# Altium schematic sheet Precharge.SchDoc
size A3
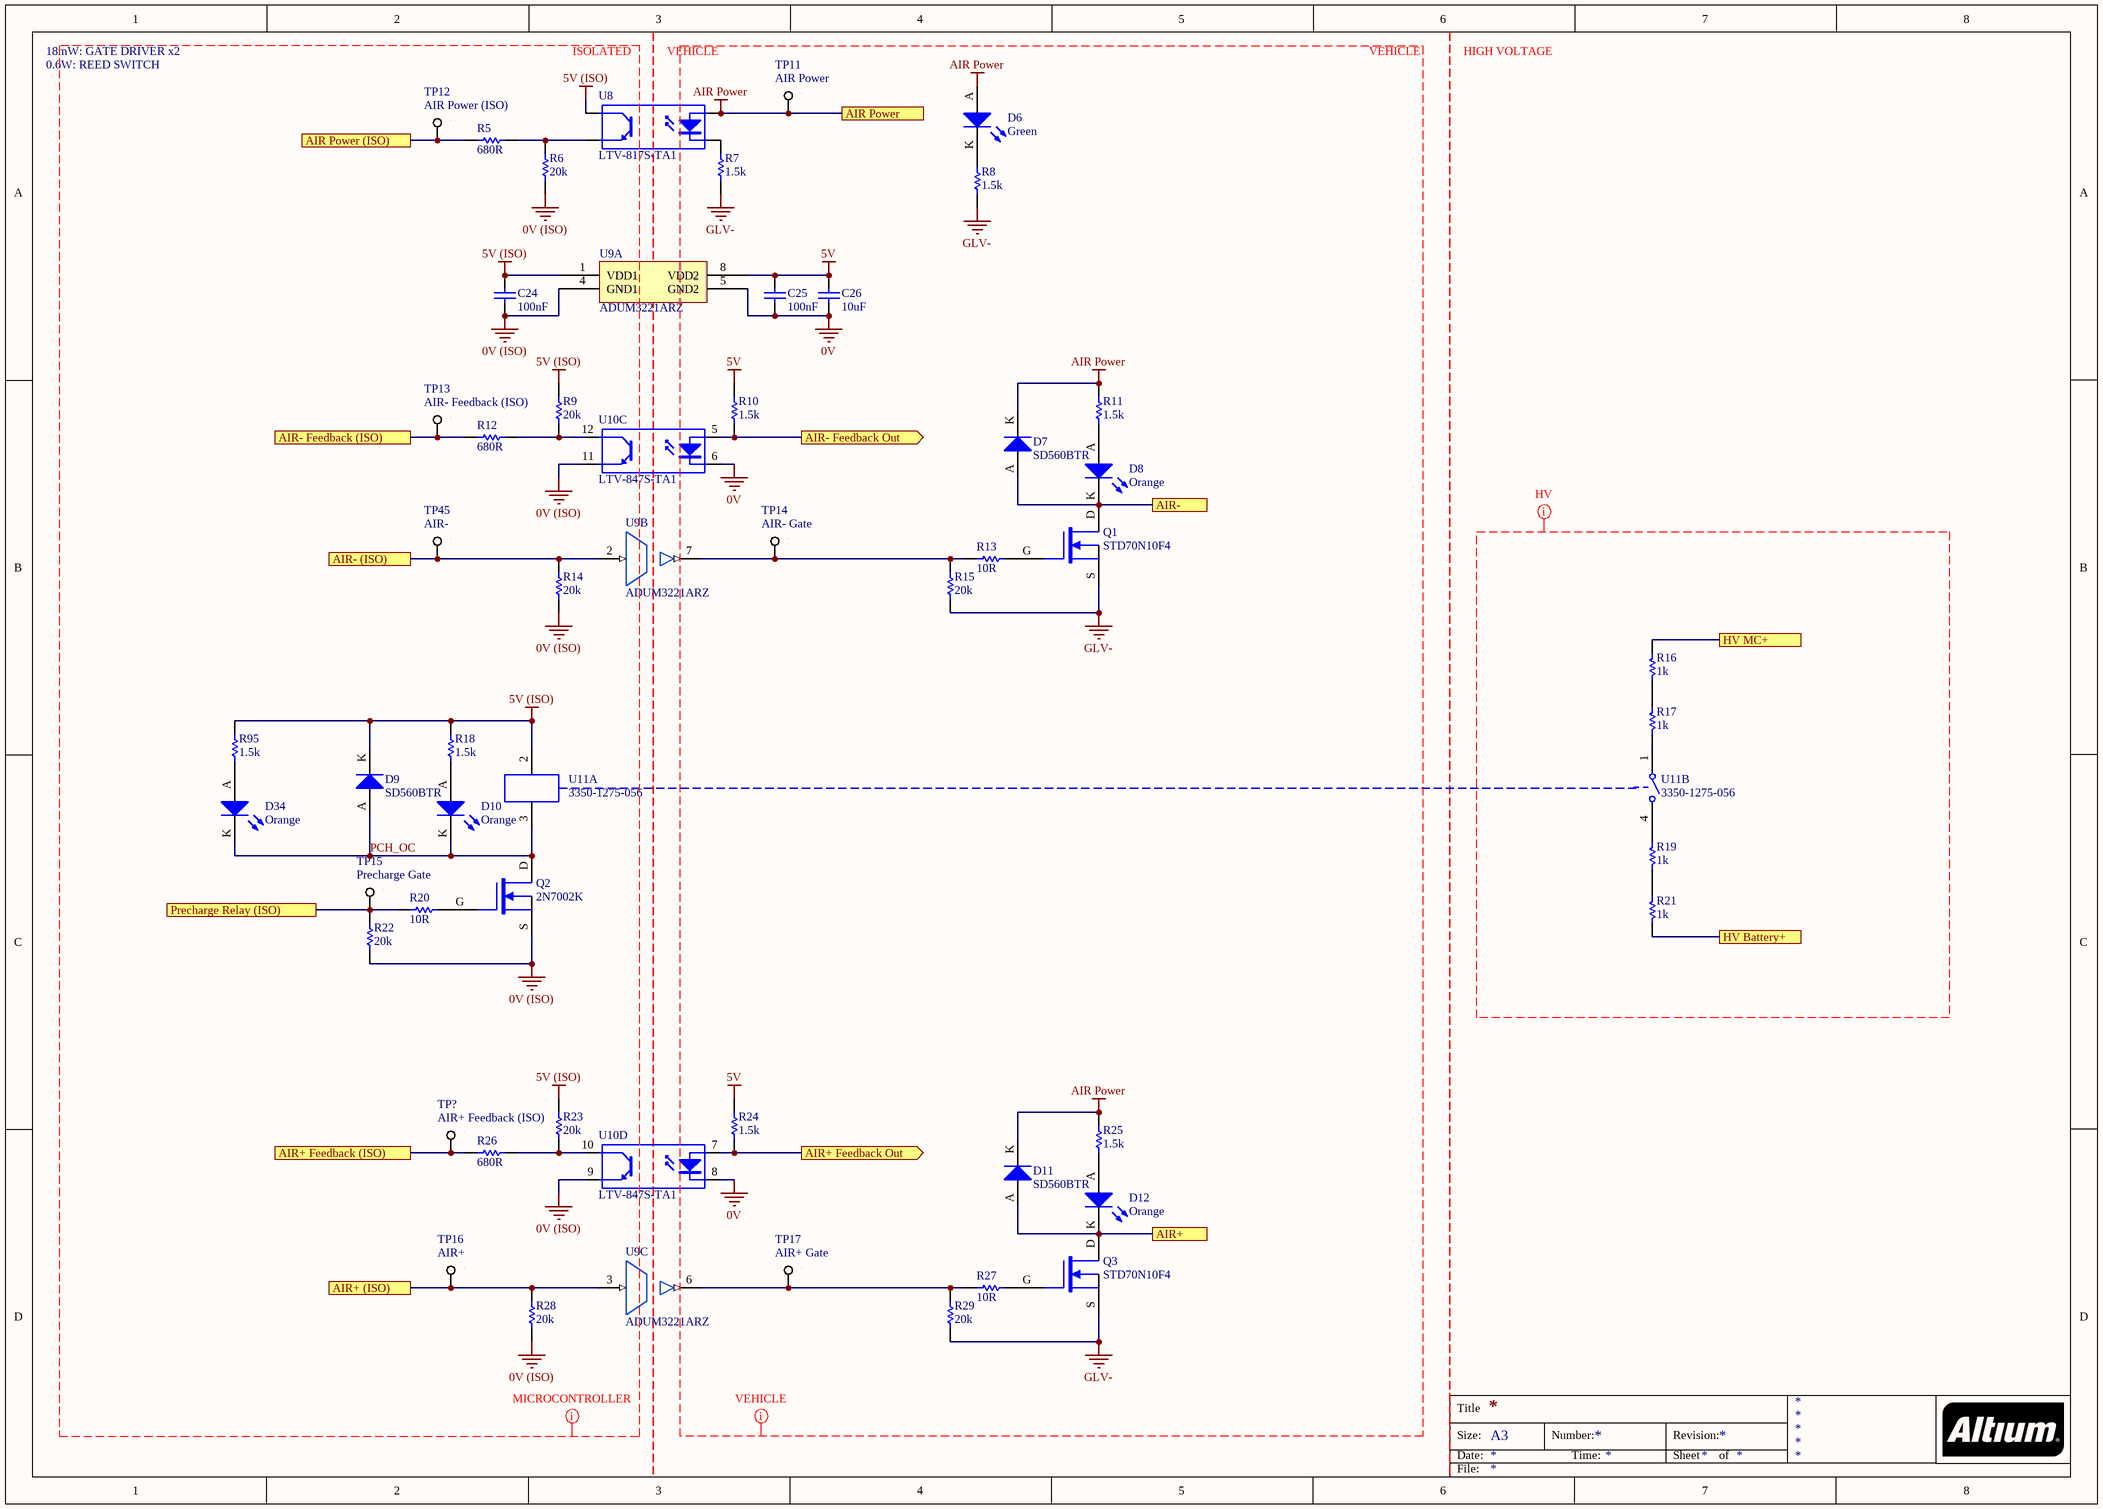
[diagram p0: Precharge.SchDoc]

## Parts
C24  100nF  [0805]
C25  100nF  [0805]
C26  10uF  [0805]
D6  Green  [0805 LED]
D7  SD560BTR  [SMB Diode]
D8  Orange  [0805 LED]
D9  SD560BTR  [SMB Diode]
D10  Orange  [0805 LED]
D11  SD560BTR  [SMB Diode]
D12  Orange  [0805 LED]
D34  Orange  [0805 LED]
Q1  STD70N10F4  [STM TO-252 MOSFET]
Q2  2N7002K  [ON SOT-23 MOSFET]
Q3  STD70N10F4  [STM TO-252 MOSFET]
R5  680R  [0805]
R6  20k  [0805]
R7  1.5k  [0805]
R8  1.5k  [0805]
R9  20k  [0805]
R10  1.5k  [0805]
R11  1.5k  [0805]
R12  680R  [0805]
R13  10R  [0805]
R14  20k  [0805]
R15  20k  [0805]
R16  1k  [B TO-263]
R17  1k  [B TO-263]
R18  1.5k  [0805]
R19  1k  [B TO-263]
R20  10R  [0805]
R21  1k  [B TO-263]
R22  20k  [0805]
R23  20k  [0805]
R24  1.5k  [0805]
R25  1.5k  [0805]
R26  680R  [0805]
R27  10R  [0805]
R28  20k  [0805]
R29  20k  [0805]
R95  1.5k  [0805]
TP11  AIR Power  [SMD Test Point 1mm]
TP12  AIR Power (ISO)  [SMD Test Point 1mm]
TP13  AIR- Feedback (ISO)  [SMD Test Point 1mm]
TP14  AIR- Gate  [SMD Test Point 1mm]
TP15  Precharge Gate  [SMD Test Point 1mm]
TP16  AIR+  [SMD Test Point 1mm]
TP17  AIR+ Gate  [SMD Test Point 1mm]
TP45  AIR-  [SMD Test Point 1mm]
TP?  AIR+ Feedback (ISO)  [SMD Test Point 1mm]
U8  LTV-817S-TA1  [ON 4-SMD]
U9  ADUM3221ARZ  [AD 8-SOIC]  (parts A,B,C of 3)
U10  LTV-847S-TA1  [ON 16-SMD]  (parts C,D of 4)
U11  3350-1275-056  [CI SPST]  (parts A,B of 2)

## Ports
AIR Power, AIR Power (ISO), AIR+, AIR+ (ISO), AIR+ Feedback (ISO), AIR+ Feedback Out (out), AIR-, AIR- (ISO), AIR- Feedback (ISO), AIR- Feedback Out (out), HV Battery+, HV MC+, Precharge Relay (ISO)

## Nets
0V: C25.1 C26.1 U9.5(GND2) U10.6(K) U10.8(K)
0V (ISO): C24.1 Q2.S R6.1 R14.1 R22.1 R28.1 U9.4(GND1) U10.9(E) U10.11(E)
5V: C25.2 C26.2 R10.2 R24.2 U9.8(VDD2)
5V (ISO): C24.2 D9.K R9.2 R18.2 R23.2 R95.2 U8.4(C) U9.1(VDD1) U11.2
AIR Power: D6.A D7.K D11.K R11.2 R25.2 TP11.1 U8.1(A) ; port AIR Power
GLV-: Q1.S Q3.S R7.2 R8.2 R15.1 R29.1
AIR Power (ISO): R5.1 TP12.1 ; port AIR Power (ISO)
AIR+: D11.A D12.K Q3.D ; port AIR+
AIR+ (ISO): R28.2 TP16.1 U9.3(VIA) ; port AIR+ (ISO)
AIR+ Feedback (ISO): R26.1 TP?.1 ; port AIR+ Feedback (ISO)
AIR+ Feedback Out: R24.1 U10.7(A) ; port AIR+ Feedback Out
AIR-: D7.A D8.K Q1.D ; port AIR-
AIR- (ISO): R14.2 TP45.1 U9.2(VIA) ; port AIR- (ISO)
AIR- Feedback (ISO): R12.1 TP13.1 ; port AIR- Feedback (ISO)
AIR- Feedback Out: R10.1 U10.5(A) ; port AIR- Feedback Out
HV Battery+: R21.1 ; port HV Battery+
HV MC+: R16.2 ; port HV MC+
PCH_OC: D9.A D10.K D34.K Q2.D U11.3
Precharge Relay (ISO): R20.1 R22.2 TP15.1 ; port Precharge Relay (ISO)
NetD6_K: D6.K R8.1
NetD8_A: D8.A R11.1
NetD10_A: D10.A R18.1
NetD12_A: D12.A R25.1
NetD34_A: D34.A R95.1
NetQ1_G: Q1.G R13.2
NetQ2_G: Q2.G R20.2
NetQ3_G: Q3.G R27.2
NetR5_2: R5.2 R6.2 U8.3(E)
NetR7_1: R7.1 U8.2(K)
NetR9_1: R9.1 R12.2 U10.12(C)
NetR13_1: R13.1 R15.2 TP14.1 U9.7(VOA)
NetR16_1: R16.1 R17.2
NetR17_1: R17.1 U11.1
NetR19_1: R19.1 R21.2
NetR19_2: R19.2 U11.4
NetR23_1: R23.1 R26.2 U10.10(C)
NetR27_1: R27.1 R29.2 TP17.1 U9.6(VOA)

## Layout directives
net class HV: (no net found under the mark)
net class VEHICLE: 0V, 5V, AIR Power, GLV-
net class MICROCONTROLLER: 0V (ISO), 5V (ISO), PCH_OC

## Notes on the sheet
- 18mW: GATE DRIVER x2
- 0.6W: REED SWITCH
- ISOLATED
- VEHICLE
- HIGH VOLTAGE
- Title
- Size:
- Date:
- A3
- Number:
- Time:
- Revision:
- Sheet
- of
- File:

## Library data of the parts
C24 C25 = GCM21BR71H104KA37L: Manufacturer: muRata; Tolerance: ±10%; Material: X7R; Rated Voltage: 50V; Part Number: GCM21BR71H104KA37L; Value: 100nF; Digikey Part Number: 490-6064-1-ND
C26 = GRM21BR6YA106KE43L: Manufacturer: muRata; Tolerance: 10%; Material: X5R; Rated Voltage: 50V; Part Number: GRM21BR6YA106KE43L; Value: 10uF; Digikey Part Number: 490-10514-6-ND
D6 = SML-210FTT86: Green LED Indication - Discrete 1.75V 0805 (2012 Metric); Manufacturer: ROHM Semiconductor; Part Number: SML-210FTT86; Colour: Green; Digikey Part Number: 511-1285-1-ND; Digikey Link: https://www.digikey.com/product-detail/en/rohm-semiconductor/SML-210FTT86/511-1285-1-ND/637098
D7 D9 D11 = SD560BTR: 1.2V_F 600V 5A SMB; Manufacturer: SMC Diode Solutions; Part Number: SD560BTR; Digikey Part Number: 1655-1530-2-ND; Digikey Link: https://www.digikey.com/product-detail/en/smc-diode-solutions/SD560BTR/1655-1530-2-ND/6022620
D8 D10 D12 D34 = SML-211DTT86: Orange LED Indication - Discrete 1.75V 0805 (2012 Metric); Manufacturer: ROHM Semiconductor; Part Number: SML-211DTT86; Colour: Orange; Digikey Part Number: 511-1291-1-ND; Digikey Link: https://www.digikey.com/product-detail/en/rohm-semiconductor/SML-211DTT86/511-1291-1-ND/637104
Q1 Q3 = STD70N10F4: N-Channel 100V 60A (Tc) 125W (Tc) Surface Mount DPAK; Manufacturer: STMicroelectronics; Published: 24-Mar-1999; LatestRevisionDate: 29-May-2009; LatestRevisionNote: IPC-7351 Footprint Added.; PackageVersion: Sep-2000; PackageReference: SOT-343; Publisher: Altium Limited; PackageDescription: 4-Pin SOT-343 Package 1.3 mm Pitch, 2.1 mm Lead Span; Part Number: STD70N10F4; Digikey Part Number: 497-8806-2-ND; Digikey Link: https://www.digikey.com/product-detail/en/stmicroelectronics/STD70N10F4/497-8806-2-ND/2035599
Q2 = 2N7002K: 60V 380mA, NFET MOSTFET (Small Signal); Manufacturer: ON Semiconductor; Published: 24-Mar-1999; LatestRevisionDate: 29-May-2009; LatestRevisionNote: IPC-7351 Footprint Added.; PackageVersion: Sep-2000; PackageReference: SOT-343; Publisher: Altium Limited; PackageDescription: 4-Pin SOT-343 Package 1.3 mm Pitch, 2.1 mm Lead Span; Part Number: 2N7002K; Digikey Part Number: 2N7002KCT-ND; Digikey Link: https://www.digikey.com/product-detail/en/on-semiconductor/2N7002K/2N7002KCT-ND/2060375; Qty: 30
R5 R12 R26 = RC0805FR07680RL: Manufacturer: YAGEO; Tolerance: 0.01; Rated Voltage: 0.125W; Part Number: RC0805FR07680RL; Value: 680R; Material: FR-07; Digikey Part Number: 311-680CRCT-ND
R6 R9 R14 R15 R22 R23 R28 R29 = RC0805FR0720KL: Manufacturer: YAGEO; Tolerance: 0.01; Rated Voltage: 0.125W; Part Number: RC0805FR0720KL; Value: 20k; Material: FR-07; Digikey Part Number: 311-20.0KCRCT-ND
R7 R8 R10 R11 R18 R24 R25 R95 = RC0805FR071K5L: Manufacturer: YAGEO; Tolerance: 0.01; Rated Voltage: 0.125W; Part Number: RC0805FR071K5L; Value: 1.5k; Material: FR-07; Digikey Part Number: 311-1.50KCRCT-ND
R13 R20 R27 = RC0805FR0710RL: Manufacturer: YAGEO; Tolerance: 0.01; Rated Voltage: 0.125W; Part Number: RC0805FR0710RL; Value: 10R; Material: FR-07; Digikey Part Number: 311-10.0CRCT-ND
R16 R17 R19 R21 = PWR263S-35-1001J: Manufacturer: Bournes Inc; Tolerance: 0.05; Rated Voltage: 35W; Part Number: PWR263S-35-1001J; Value: 1k; Digikey Part Number: PWR263S-35-1001J-ND
TP11-TP17 TP45 TP? = SMD Test Point Small: Positions: 1; Pitch: 0mm; Row Spacing: 0; Flange: No; Contact: NA; Part Number: SMD Test Point Small; Angle: 0
U8 = LTV-817S-TA1: 35V 50ma Optocoupler (VF=1.2V); Manufacturer: Lite-On Inc; Part Number: LTV-817S-TA1; Digikey Part Number: 160-1893-2-ND; Digikey Link: https://www.digikey.com/product-detail/en/lite-on-inc/LTV-817S-TA1/160-1893-2-ND/388451
U9 = ADUM3221ARZ: 4A Gate Driver Magnetic Coupling 2500Vrms 2 Channel 8-SOIC; Manufacturer: Analog Devices; Part Number: ADUM3221ARZ; Digikey Part Number: ADUM3221ARZ-ND; Digikey Link: https://www.digikey.com/product-detail/en/analog-devices-inc/ADUM3221ARZ/ADUM3221ARZ-ND/2616333
U10 = LTV-847S-TA1: Optoisolator Transistor Output 5000Vrms 4 Channel 16-SMD; Manufacturer: Lite-On Inc; Part Number: LTV-847S-TA1; Digikey Part Number: 160-1371-5-ND; Digikey Link: https://www.digikey.com.au/product-detail/en/lite-on-inc/LTV-847S/160-1371-5-ND/385841
U11 = 3350-1275-056: RELAY REED HV SPST 200W 3A 5V (NO); Manufacturer: Comus International; Part Number: 3350-1275-056; Digikey Part Number: 1835-1036-ND; Digikey Link: https://www.digikey.com.au/product-detail/en/comus-international/3350-1275-056/1835-1036-ND/7515918